# EAGLE design bb-psu-mk-1.2 (EAGLE 6.5.0)
VERSION: 1.0
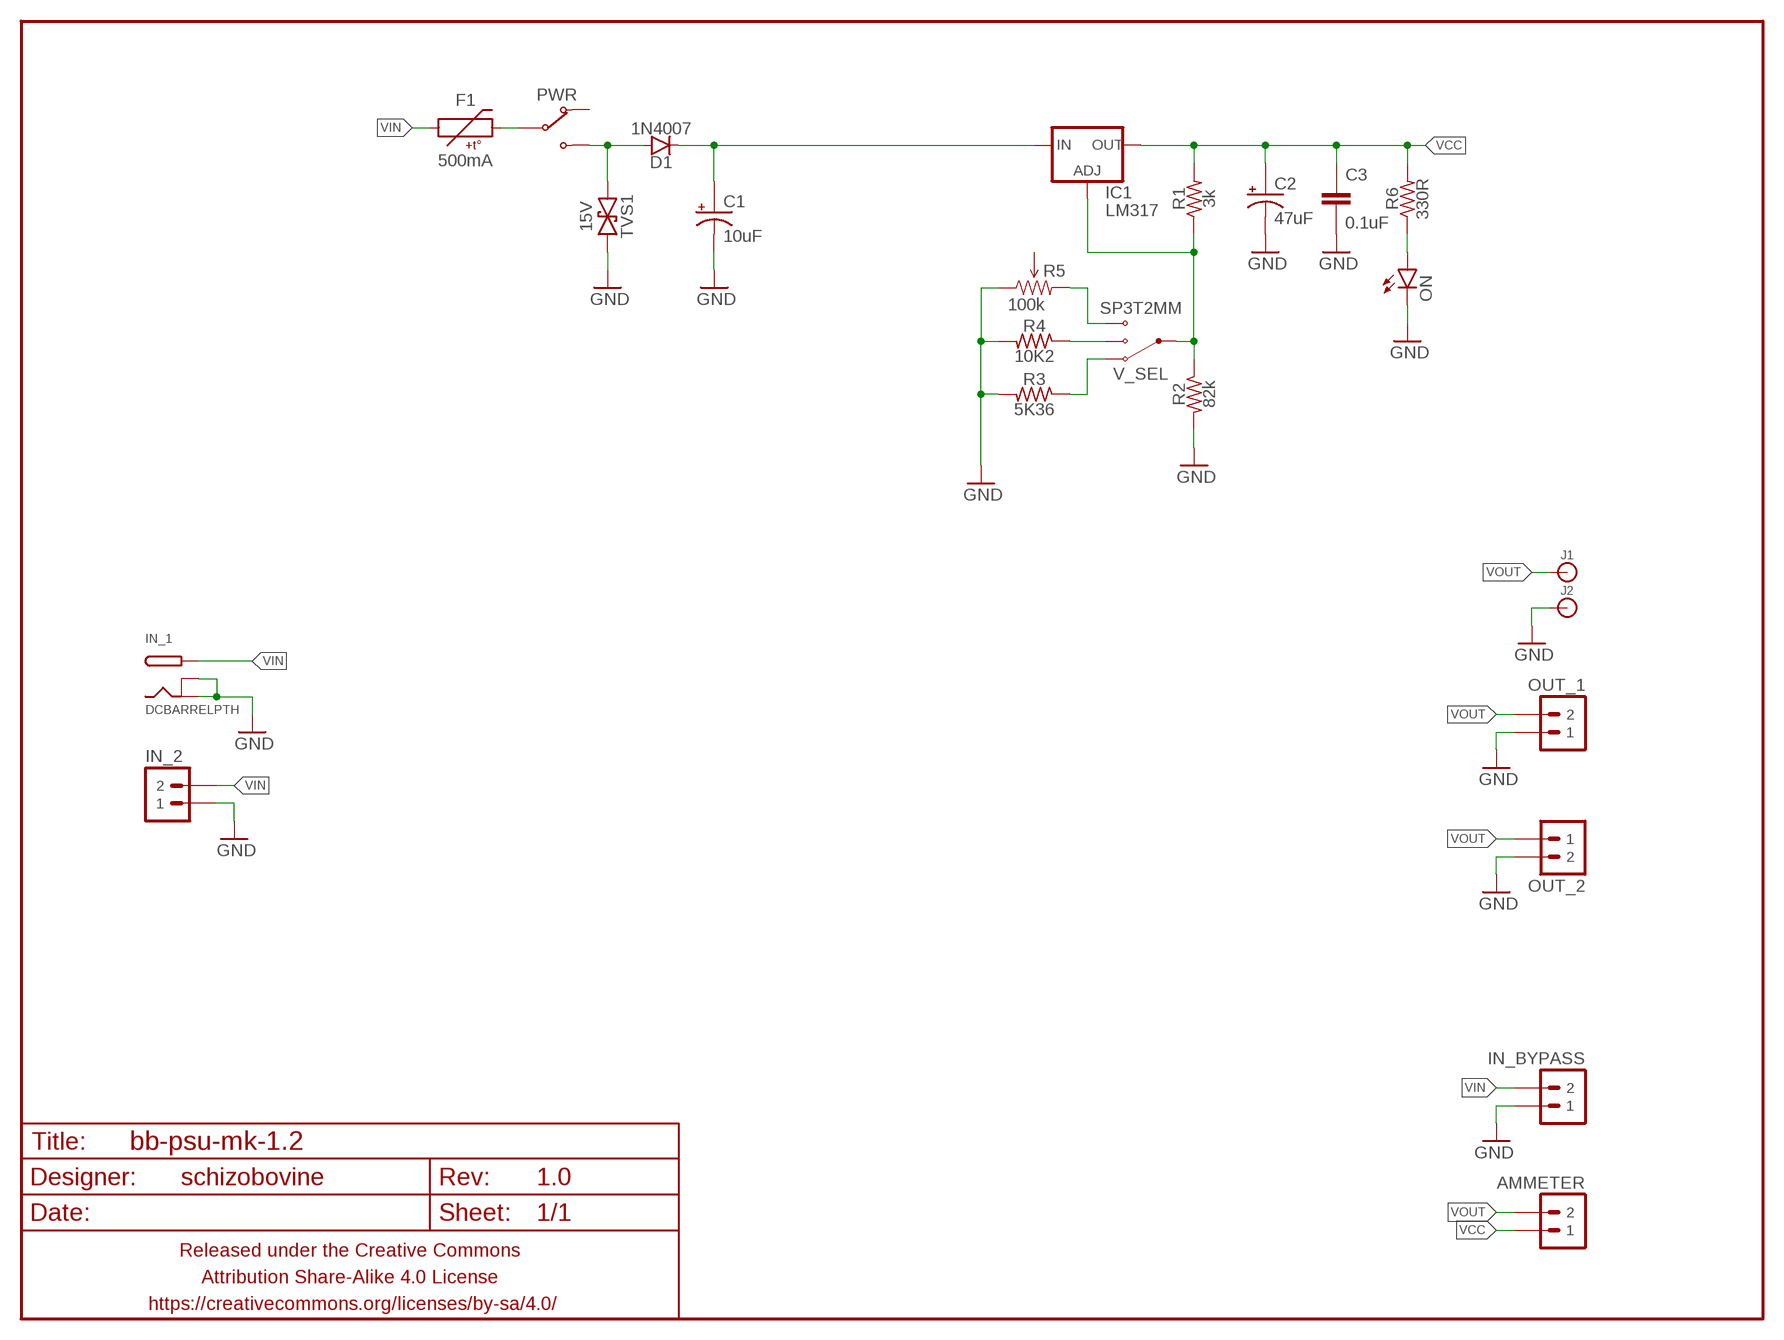
[diagram p0: schematic, sheet 1]

## Parts
AMMETER  M02PTH-CENTERED  [1X02-CENTER]
C1  10uF  CAPACITOR-POLARIZEDE2.5-6  [E2,5-6]
C2  47uF  CAPACITOR-POLARIZEDE2.5-6  [E2,5-6]
C3  0.1uF  CAPACITOR-CERAMIC025-024X044  [C025-024X044]
D1  1N4007  DIODEPTH-10.68MM  [DIODE-10.16MM]
F1  500mA  PTCPTH-5.08MM  [PTC-PTH-5.08MM]
FRAME1  FRAME-LETTERNO_PACKAGE  [DUMMY]
IC1  LM317  V_REG_317THERMPAD  [TO220-THERMPAD]
IN_1  DCBARRELPTH  [DCJACK_2MM_PTH]
IN_2  M02PTH-CENTERED-R+  [1X02-CENTER-R+]
IN_BYPASS  M02PTH-CENTERED-R+  [1X02-CENTER-R+]
J1  BANANA_CONNPOAST  [BINDING_POST]
J2  BANANA_CONNPOAST  [BINDING_POST]
ON  LED3MM-LESS  [LED3MM-LESSSILK]
OUT_1  M02PTH-CENTERED-R+  [1X02-CENTER-R+]
OUT_2  M023.5MM  [SCREWTERMINAL-3.5MM-2]
PWR  SWITCH-SPDTPTH-VERT-2.54MM  [SWITCH-SPDT]
R1  3k  RESISTORPTH-AXIAL-7.62MM  [RESISTOR-AXIAL-PTH-7.62MM]
R2  82k  RESISTORPTH-AXIAL-7.62MM  [RESISTOR-AXIAL-PTH-7.62MM]
R3  5K36  RESISTORPTH-AXIAL-7.62MM  [RESISTOR-AXIAL-PTH-7.62MM]
R4  10K2  RESISTORPTH-AXIAL-7.62MM  [RESISTOR-AXIAL-PTH-7.62MM]
R5  100k  TRIMPOT-PTH-KNOB  [3386U]
R6  330R  RESISTORPTH-AXIAL-6.35MM  [RESISTOR-AXIAL-PTH-6.35MM]
TVS1  15V  TVSDO-41-10.16MM  [DO-41-TVS-BI-10.16MM]
V_SEL  SP3T2MM  [SP3T-2MM]

## Nets
GND: C1.- C2.- C3.2 IN_1.BRK IN_1.GND IN_2.1 IN_BYPASS.1 J2.P$1 ON.K(C) OUT_1.1 OUT_2.2 R2.P$2 R3.P$2 R4.P$2 R5.1(CCW) TVS1.P$2
N$1: D1.A PWR.3(NO) TVS1.P$1
N$2: C1.+ D1.C IC1.3(IN)
N$3: F1.P$2 PWR.2(COM)
N$4: ON.A R6.P$1
N$5: R4.P$1 V_SEL.P$3(B)
N$6: IC1.1(ADJ) R1.P$1 R2.P$1 V_SEL.P$1(COM)
N$7: R3.P$1 V_SEL.P$2(A)
N$8: R5.3(CW) V_SEL.P$4(C)
VCC: AMMETER.1 C2.+ C3.1 IC1.2@1(OUT) IC1.2@2(OUT) R1.P$2 R6.P$2
VIN: F1.P$1 IN_1.PWR IN_2.2 IN_BYPASS.2
VOUT: AMMETER.2 J1.P$1 OUT_1.2 OUT_2.1
Unconnected: PWR.1(NC) R5.2(WIPER)

## Library data of the parts
AMMETER IN_2 IN_BYPASS OUT_1 OUT_2 = A_butts:M02: Standard 2-pin 0.1" header. Use with - straight break away headers ( PRT-00116) - right angle break away headers (PRT-00553) - swiss pins (PRT-00743) - machine pins (PRT-00117) - female headers (PRT-00115) Molex polarized connector foot print use with: PRT-08233 with associated crimp pins and housings. 2.54_SCREWTERM for use with PRT-10571. 3.5mm Screw Terminal footprints for PRT-08084 5mm Screw Terminal footprints for use with PRT-08433
C1 C2 = A_butts:CAPACITOR-POLARIZED: POLARIZED CAPACITOR, American symbol
C3 = A_butts:CAPACITOR-CERAMIC: CAPACITOR, European symbol
D1 = A_butts:DIODE: Diode These are standard reverse protection diodes and small signal diodes. SMA package can handle up to about 1A. SOD-323 can handle about 200mA. What the SOD-323 package when ordering, there are some mfgs out there that are 5-pin packages.
F1 = A_butts:PTC: Resettable Fuse PTC Resettable Fuse. Spark Fun Electronics SKU : COM-08357
FRAME1 = A_butts:FRAME-LETTER: Schematic Frame Standard 8.5x11 US Letter frame; DESIGNER: schizobovine; VERSION: 1.0
IC1 = A_butts:V_REG_317: Voltage Regulator Standard LM317 adjustable voltage regulator. AOI (Adjust Output Input). Google 'LM317 Calculator' for easy to use app to get the two resistor values needed. 240/720 for 5V output. 240/390 for 3.3V output. Spark Fun Electronics SKU : COM-00527
IN_1 = A_butts:DCBARREL: 2.0mm DC Barrel Jack DCJACK_2MM_PTH - Through Hole Jack (4UConnector: 05537)
J1 J2 = A_butts:BANANA_CONN: Through-hole banana jack
ON = A_butts:LED: LEDs Standard schematic elements and footprints for 5mm, 3mm, 1206, and 0603 sized LEDs. 5mm - Spark Fun Electronics SKU : COM-00529 (and others)
PWR = A_butts:SWITCH-SPDT
R1-R4 R6 = A_butts:RESISTOR: RESISTOR, American symbol
R5 = A_butts:TRIMPOT: Various small potentiometers for "set-and-forget" applications
TVS1 = A_butts:TVS: Transient voltage suppressor- prevents ESD on inputs. Ignore package description- MBRA140 is NOT this type of part!!!
V_SEL = A_butts:SP3T

## Board
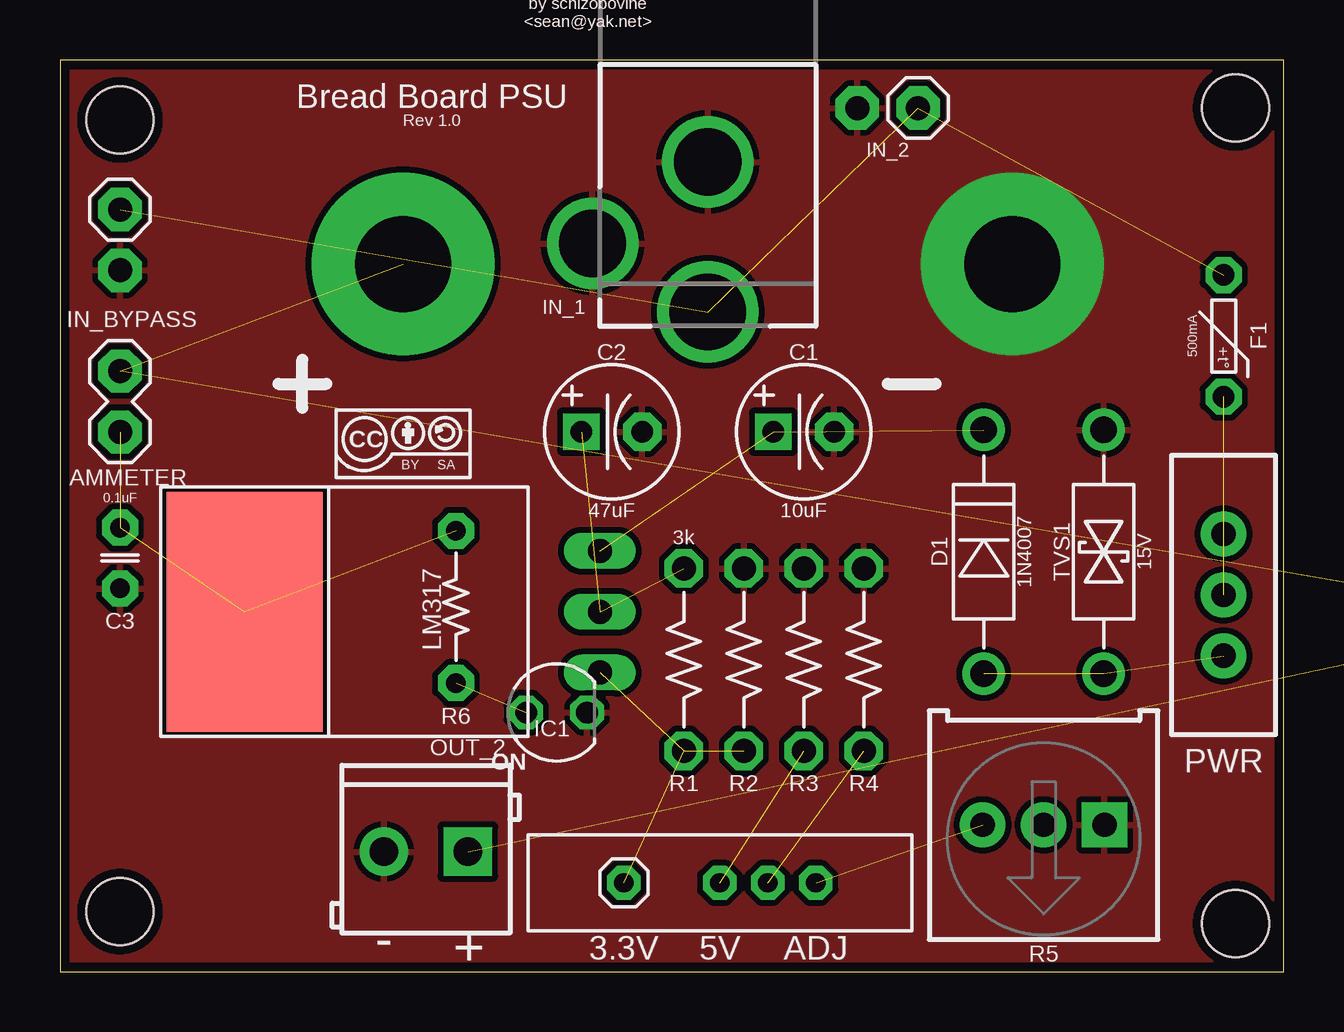
[diagram p1: board, top side]
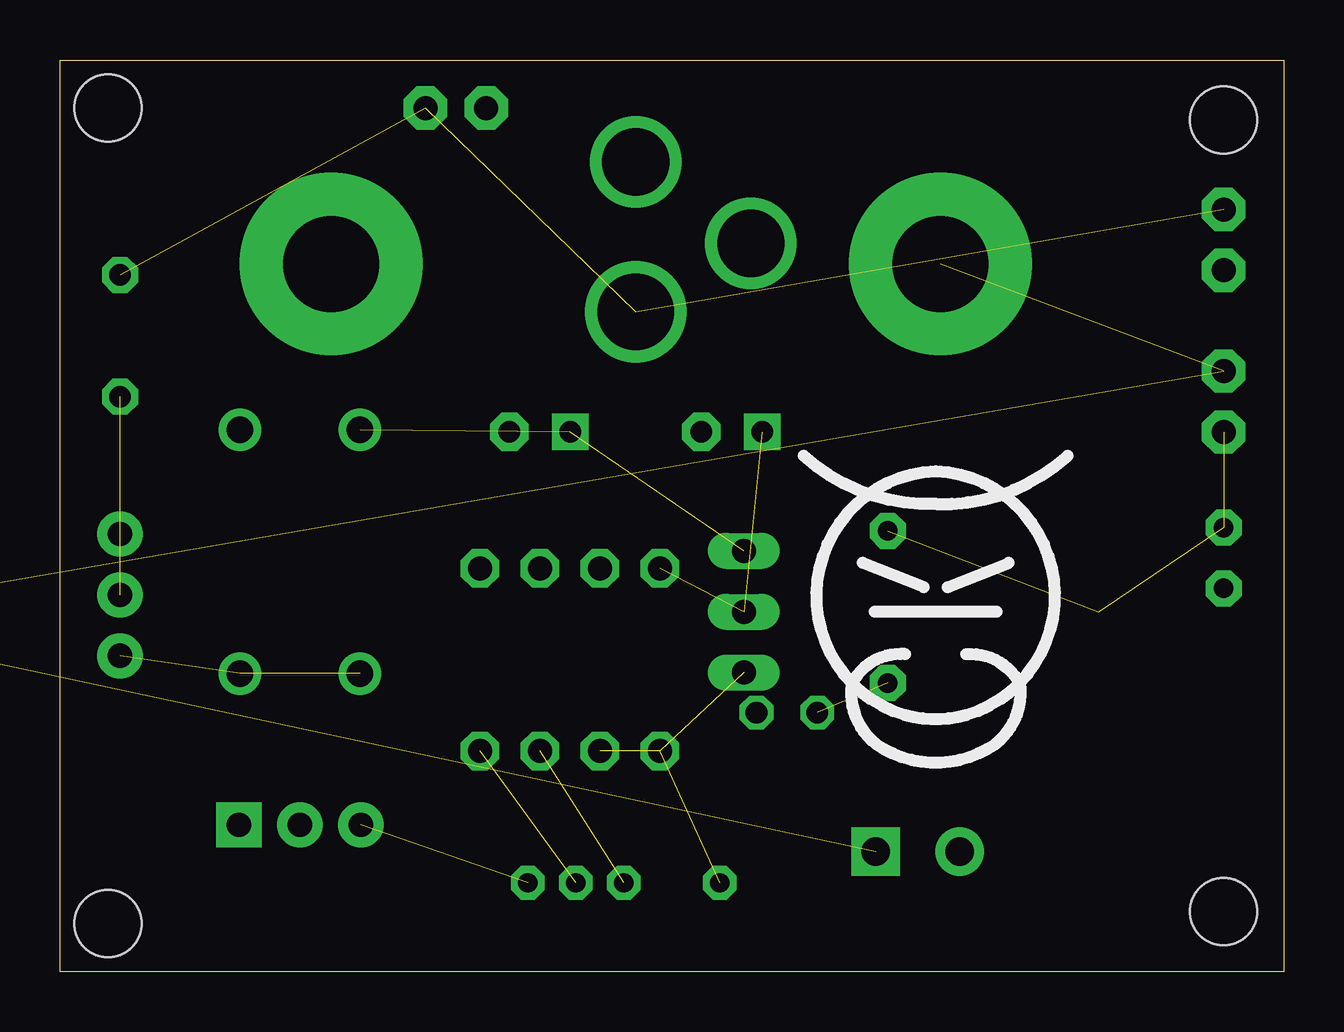
[diagram p2: board, bottom side, seen from below]

Size 51 x 38 mm. Coordinates in mm from the lower left corner, seen from the top.
Outline: 0,38 0,0 51,0 51,38 0,38
Copper layers (1*16): Top 0.0356mm / dielectric 1.5011mm / Bottom 0.0356mm
Design rules "LaenPCBOrder2": minimum track width 6mil, minimum drill 13mil, track to track 6mil, track to pad 6mil, pad to pad 6mil, via to via 6mil, smd to smd 6mil, copper to edge 15mil, drill to drill 6mil, minimum pad ring 7mil, minimum via ring 7mil, stop-mask expansion 3mil, vias tented up to drill 20mil, thermal gap 10mil
Holes 2.8 mm at 2.5,35.5 2.5,2.5 49,2 49,36

### Footprints (pad centres in the part's own frame; a part is rotated, then mirrored left to right if it is on the bottom)
1X02-CENTER = drill 1 pad 1.8 octagon: 1 -1.27,0; 2 1.27,0
E2,5-6 = drill 0.9 pad 1.524 square: + -1.27,0 | drill 0.9 pad 1.6 octagon: - 1.27,0
C025-024X044 = drill 0.813 pad 1.5 octagon: 1 -1.27,0; 2 1.27,0
DIODE-10.16MM = drill 1.1 pad 1.778: A -5.08,0; C 5.08,0
PTC-PTH-5.08MM = drill 0.9 pad 1.5 octagon: P$1 -2.54,0; P$2 2.54,0
TO220-THERMPAD = drill 1 long: 1 -2.54,0; 2@2 0,0; 3 2.54,0 | smd 10 x 6.5: 2@1 0,14.81
DCJACK_2MM_PTH = drill 2.8: BRK -4.8,2.85; GND 0,6.25 | drill 3.2: PWR 0,0
1X02-CENTER-R+ = drill 1 pad 1.8 octagon: 1 -1.27,0; 2 1.27,0
BINDING_POST = drill 4 pad 7.62: P$1 0,0
LED3MM-LESSSILK = drill 0.9 pad 1.4 octagon: A -1.27,0; K 1.27,0
SCREWTERMINAL-3.5MM-2 = drill 1.2 pad 2.032 square: 1 0,0 | drill 1.2 pad 2.032: 2 3.5,0
SWITCH-SPDT = drill 1.016 pad 1.88: 1 0,2.54; 2 0,0; 3 0,-2.54
RESISTOR-AXIAL-PTH-7.62MM = drill 1 pad 1.6 octagon: P$1 -3.81,0; P$2 3.81,0
3386U = drill 1.016 pad 1.88 square: 1 -2.54,-0.015 | drill 1.016 pad 1.88: 2 0,-0.015; 3 2.54,-0.015
RESISTOR-AXIAL-PTH-6.35MM = drill 0.8 pad 1.5 octagon: P$1 -3.175,0; P$2 3.175,0
DO-41-TVS-BI-10.16MM = drill 1.1 pad 1.778: P$1 -5.08,0; P$2 5.08,0
SP3T-2MM = drill 0.8 pad 1.4 octagon: P$1 -4,0; P$2 0,0; P$3 2,0; P$4 4,0

### Placement (x,y rotation side)
AMMETER  2.5,23.76 90 top
C1  31,22.5 0 top
C2  23,22.5 0 top
C3  2.5,17.24 270 top
D1  38.5,17.5 90 top
F1  48.5,26.5 270 top
FRAME1  0,0 0 top
IC1  22.5,15 90 top
IN_1  27,27.5 0 top
IN_2  34.5,36 0 top
IN_BYPASS  2.5,30.5 90 top
J1  14.3,29.5 0 top
J2  39.7,29.5 0 top
ON  20.7,10.8 0 top
OUT_1  61.1,14.7 0 top  (outside the outline)
OUT_2  17,5 180 top
PWR  48.5,15.7 0 top
R1  26,13 90 top
R2  28.5,13 90 top
R3  31,13 90 top
R4  33.5,13 90 top
R5  41,6.1 180 top
R6  16.5,15.2 90 top
TVS1  43.5,17.5 90 top
U$1  [CC-BY-SA-4.0-NO-URL]  59.5,31.5 0 bottom  (outside the outline)
U$2  [CC-BY-SA-4.0-NO-URL]  14.3,22 0 top
U$3  [COW]  14.5,14.5 0 bottom
V_SEL  27.5,3.7 0 top

### Tracks (layer width: path | path; a pad name or v marks a point on that pad's centre or on a via)
GND
  pour Top (isolate 0.25): 0,38 51,38 51,0 0,0
N$1  (2 unrouted)
N$2  (2 unrouted)
N$3  (1 unrouted)
N$4  (1 unrouted)
N$5  (1 unrouted)
N$6  (3 unrouted)
N$7  (1 unrouted)
N$8  (1 unrouted)
VCC  (5 unrouted)
VIN  (3 unrouted)
VOUT  (3 unrouted)

### Text on the board
tPlace: by schizobovine / <sean@yak.net> | Bread Board PSU | - | + | 3.3V | 5V | ADJ | - | +
bPlace: by schizobovine / <sean@yak.net>